# Altium project uz_frontpanel_main.PrjPCB (part 1 of 3)
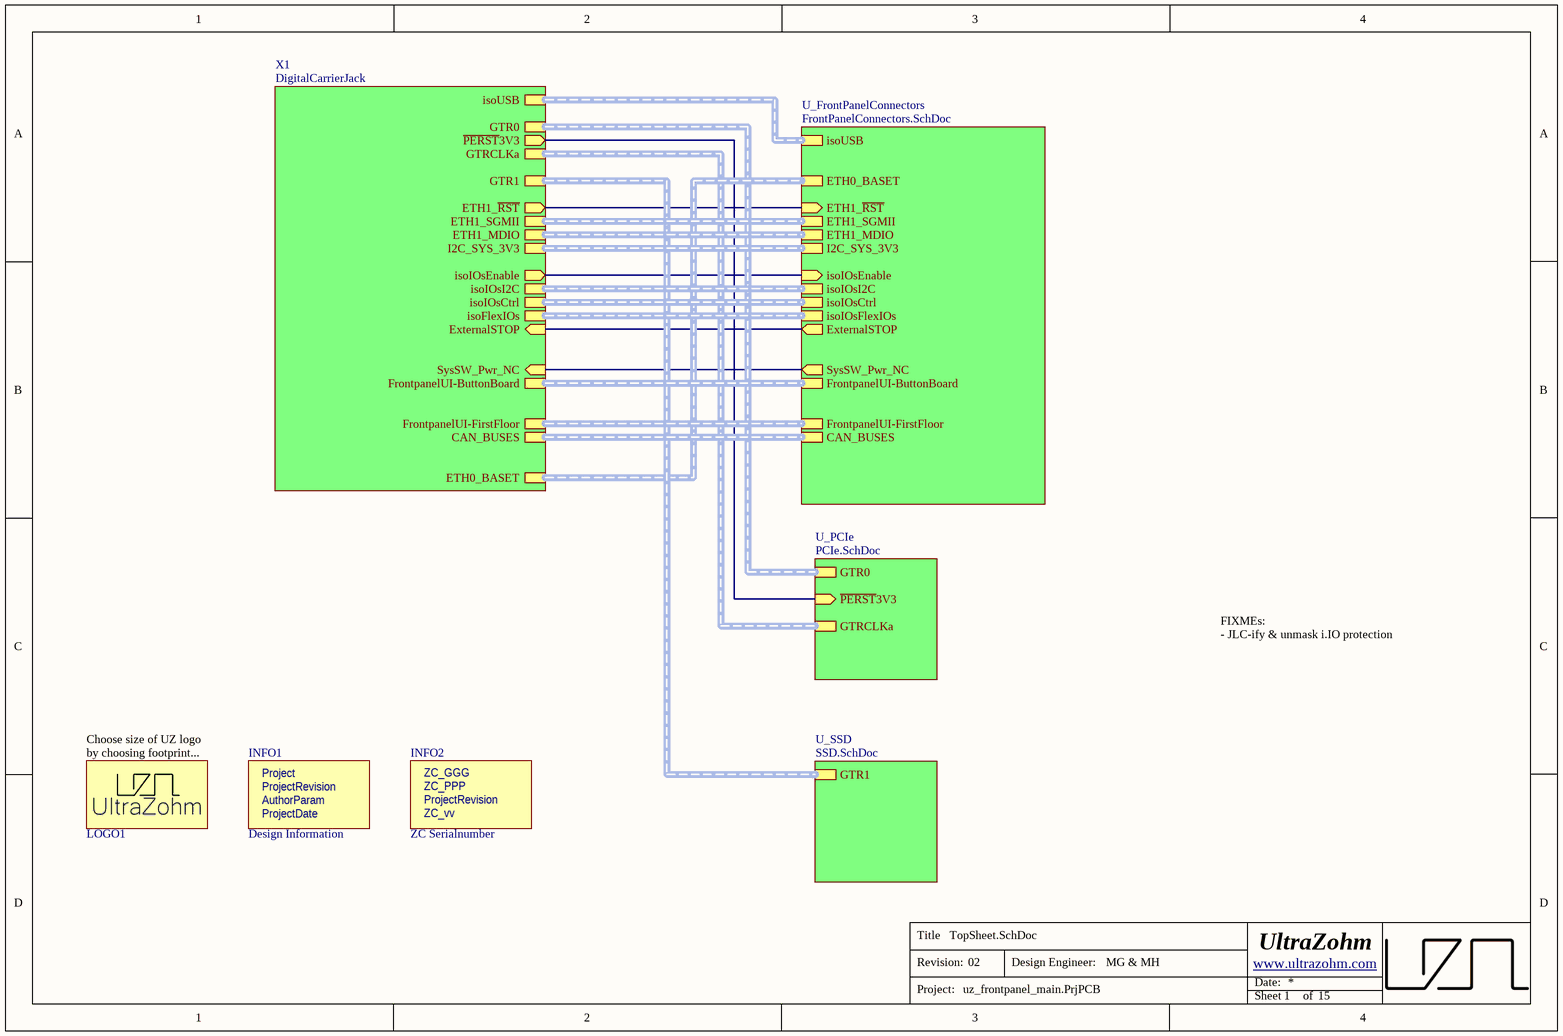
[diagram p0: TopSheet.SchDoc]
AuthorParam: MG & MH; Project: uz_frontpanel_main; ProjectDate: 04/25; ProjectRevision: 02; ZC_GGG: 004; ZC_PPP: 004; Organization: UltraZohm; Website: www.ultrazohm.com
14 sheets, 269 parts. Net scope: hierarchical (ports join the sheet entries above them; power ports are global).
Board file: uz_frontpanel_main.PcbDoc
Sheets:
  TopSheet.SchDoc
    X1 = DigitalCarrierJack.SchDoc
    U_FrontPanelConnectors = FrontPanelConnectors.SchDoc
      U_FPC-isoJTAG = FPC-isoJTAG.SchDoc
      U_FPC-ETH-DualRJ45 = FPC-ETH-DualRJ45.SchDoc
      U_PCB-ButtonBoard = PCB-ButtonBoard.SchDoc
      U_FPC-isoIOs = FPC-isoIOs.SchDoc
        U_FPC-isoIOs-IOpQuad0104 = FPC-isoIOs-IOpQuad.SchDoc
          IOp1 = FPC-isoIOs-IOpSingle.SchDoc
          IOp2 = FPC-isoIOs-IOpSingle.SchDoc
          IOp3 = FPC-isoIOs-IOpSingle.SchDoc
          IOp4 = FPC-isoIOs-IOpSingle.SchDoc
        U_FPC-isoIOs-IOpQuad0508 = FPC-isoIOs-IOpQuad.SchDoc
          IOp1 = FPC-isoIOs-IOpSingle.SchDoc
          IOp2 = FPC-isoIOs-IOpSingle.SchDoc
          IOp3 = FPC-isoIOs-IOpSingle.SchDoc
          IOp4 = FPC-isoIOs-IOpSingle.SchDoc
        U_FPC-isoIOs-IOpQuad0912 = FPC-isoIOs-IOpQuad.SchDoc
          IOp1 = FPC-isoIOs-IOpSingle.SchDoc
          IOp2 = FPC-isoIOs-IOpSingle.SchDoc
          IOp3 = FPC-isoIOs-IOpSingle.SchDoc
          IOp4 = FPC-isoIOs-IOpSingle.SchDoc
        U_FPC-isoIOs-IOpQuad1316 = FPC-isoIOs-IOpQuad.SchDoc
          IOp1 = FPC-isoIOs-IOpSingle.SchDoc
          IOp2 = FPC-isoIOs-IOpSingle.SchDoc
          IOp3 = FPC-isoIOs-IOpSingle.SchDoc
          IOp4 = FPC-isoIOs-IOpSingle.SchDoc
        U_FPC-isoIOs-Power_Protection_AP22653 = FPC-isoIOs-Power_Protection_AP22653.SchDoc
      U_ETH_SGMII-PHY = ETH-PHY_SGMII.SchDoc
      U_PCB-FirstFloor = PCB-FirstFloor.SchDoc
    U_SSD = SSD.SchDoc
    U_PCIe = PCIe.SchDoc

## Sheet TopSheet.SchDoc
size A4; Organization: UltraZohm; SheetNumber: 1; SheetTotal: 15

### Parts
INFO1  Design Information  [Design_info2]  (no BOM)
INFO2  ZC Serialnumber  [ZC-Serial]  (no BOM)
LOGO1  UZ Logo  [UZ_Logo_small]  (value not drawn)  (no BOM)

### Sub-sheets
U_FrontPanelConnectors = FrontPanelConnectors.SchDoc: isoUSB (harness USB), ETH0_BASET (harness ETH_BASET), ETH1_~{RST} (in), ETH1_SGMII (harness ETH_SGMII), ETH1_MDIO (harness ETH_MDIO), isoIOsEnable (in), isoIOsI2C (harness I2C), isoIOsCtrl (harness isoIOsCtrl), isoIOsFlexIOs (harness isoFlexIOs), ExternalSTOP (out), SysSW_Pwr_NC (out), FrontpanelUI-ButtonBoard (harness FrontpanelUI-ButtonBoard), FrontpanelUI-FirstFloor (harness FrontpanelUI-FirstFloor), CAN_BUSES (harness CAN_BUSES), I2C_SYS_3V3 (harness I2C)
U_PCIe = PCIe.SchDoc: GTR0 (harness GTR), ~{PERST}3V3 (in), GTRCLKa (harness MGTCLK)
U_SSD = SSD.SchDoc: GTR1 (harness GTR)
X1 = DigitalCarrierJack: isoUSB (harness USB), ETH0_BASET (harness ETH_BASET), ETH1_~{RST} (out), ETH1_SGMII (harness ETH_SGMII), ETH1_MDIO (harness ETH_MDIO), GTR0 (harness GTR), ~{PERST}3V3 (out), GTRCLKa (harness MGTCLK), GTR1 (harness GTR), isoIOsEnable (out), isoIOsI2C (harness I2C), isoIOsCtrl (harness isoIOsCtrl), isoFlexIOs (harness isoFlexIOs), ExternalSTOP (in), SysSW_Pwr_NC (in), FrontpanelUI-ButtonBoard (harness FrontpanelUI-ButtonBoard), FrontpanelUI-FirstFloor (harness FrontpanelUI-FirstFloor), CAN_BUSES (harness CAN_BUSES), I2C_SYS_3V3 (harness I2C)

### Nets
ETH1_~{RST}: sheet X1/ETH1_~{RST}, sheet U_FrontPanelConnectors/ETH1_~{RST}
ExternalSTOP: sheet X1/ExternalSTOP, sheet U_FrontPanelConnectors/ExternalSTOP
isoIOsEnable: sheet X1/isoIOsEnable, sheet U_FrontPanelConnectors/isoIOsEnable
~{PERST}3V3: sheet X1/~{PERST}3V3, sheet U_PCIe/~{PERST}3V3
SysSW_Pwr_NC: sheet X1/SysSW_Pwr_NC, sheet U_FrontPanelConnectors/SysSW_Pwr_NC

### Buses and harness runs
harness sheet U_FrontPanelConnectors/CAN_BUSES = sheet X1/CAN_BUSES
harness sheet U_FrontPanelConnectors/ETH0_BASET = sheet X1/ETH0_BASET
harness sheet U_FrontPanelConnectors/ETH1_MDIO = sheet X1/ETH1_MDIO
harness sheet U_FrontPanelConnectors/ETH1_SGMII = sheet X1/ETH1_SGMII
harness sheet U_FrontPanelConnectors/FrontpanelUI-ButtonBoard = sheet X1/FrontpanelUI-ButtonBoard
harness sheet U_FrontPanelConnectors/FrontpanelUI-FirstFloor = sheet X1/FrontpanelUI-FirstFloor
harness sheet U_FrontPanelConnectors/I2C_SYS_3V3 = sheet X1/I2C_SYS_3V3
harness sheet U_FrontPanelConnectors/isoIOsCtrl = sheet X1/isoIOsCtrl
harness sheet U_FrontPanelConnectors/isoIOsFlexIOs = sheet X1/isoFlexIOs
harness sheet U_FrontPanelConnectors/isoIOsI2C = sheet X1/isoIOsI2C
harness sheet U_FrontPanelConnectors/isoUSB = sheet X1/isoUSB
harness sheet U_PCIe/GTR0 = sheet X1/GTR0
harness sheet U_PCIe/GTRCLKa = sheet X1/GTRCLKa
harness sheet U_SSD/GTR1 = sheet X1/GTR1

### Notes on the sheet
- (near LOGO1) Choose size of UZ logo by choosing footprint...
- FIXMEs:
  - JLC-ify & unmask i.IO protection
- Title
- Revision:
- Design Engineer:
- Date:
- Project:
- Sheet
- of
- (in symbol Design Information) Project; ProjectRevision; AuthorParam; ProjectDate
- (in symbol ZC-Serial) ZC_GGG; ZC_PPP; ProjectRevision; ZC_vv

### Library data of the parts
INFO1 = Design Information: Manufacturer: UltraZohm; Created from: MGremer; Manufacturer Part Number: Design Information; PartID: 12; Created On: 03/11/2021 09:04:23; ComponentLink1Description: https://docs.ultrazohm.com/; ComponentLink1URL: homepage; Component Type: Design Information; Last Updated: 15/04/2025 09:29:36; Supplier 1: -; Supplier Part Number 1: -; Type: Design Information; Value: Design Information; Live Cycle Status: 1
INFO2 = ZC-Serial: Manufacturer: UltraZohm; Value: GGG-PPP-VVvv; Created from: FRosner; Manufacturer Part Number: ZC-Serial; PartID: 58; Created On: 15/04/2025 09:17:14; ComponentLink1Description: https://docs.ultrazohm.com/; ComponentLink1URL: homepage; Component Type: ZC Serialnumber; Last Updated: 15/04/2025 09:17:14; Supplier 1: -; Supplier Part Number 1: -; Type: Serial Number; Live Cycle Status: 1
LOGO1 = 1: Official Project Logo of the UltraZohm; Manufacturer: PCB Manufacturer; Manufacturer Part Number: UltraZohm Logo; Created from: T. Wendt; PartID: 1; Created On: 19.02.2021 16:55:56; ComponentLink1Description: Homepage; ComponentLink1URL: https://ultrazohm.com; Component Type: Logo; Last Updated: 02.03.2021 14:31:24; Type: Standard (No BOM); Live Cycle Status: 1

## Sheet DigitalCarrierJack.SchDoc
size A4; Organization: UltraZohm; SheetNumber: 2; SheetTotal: 15
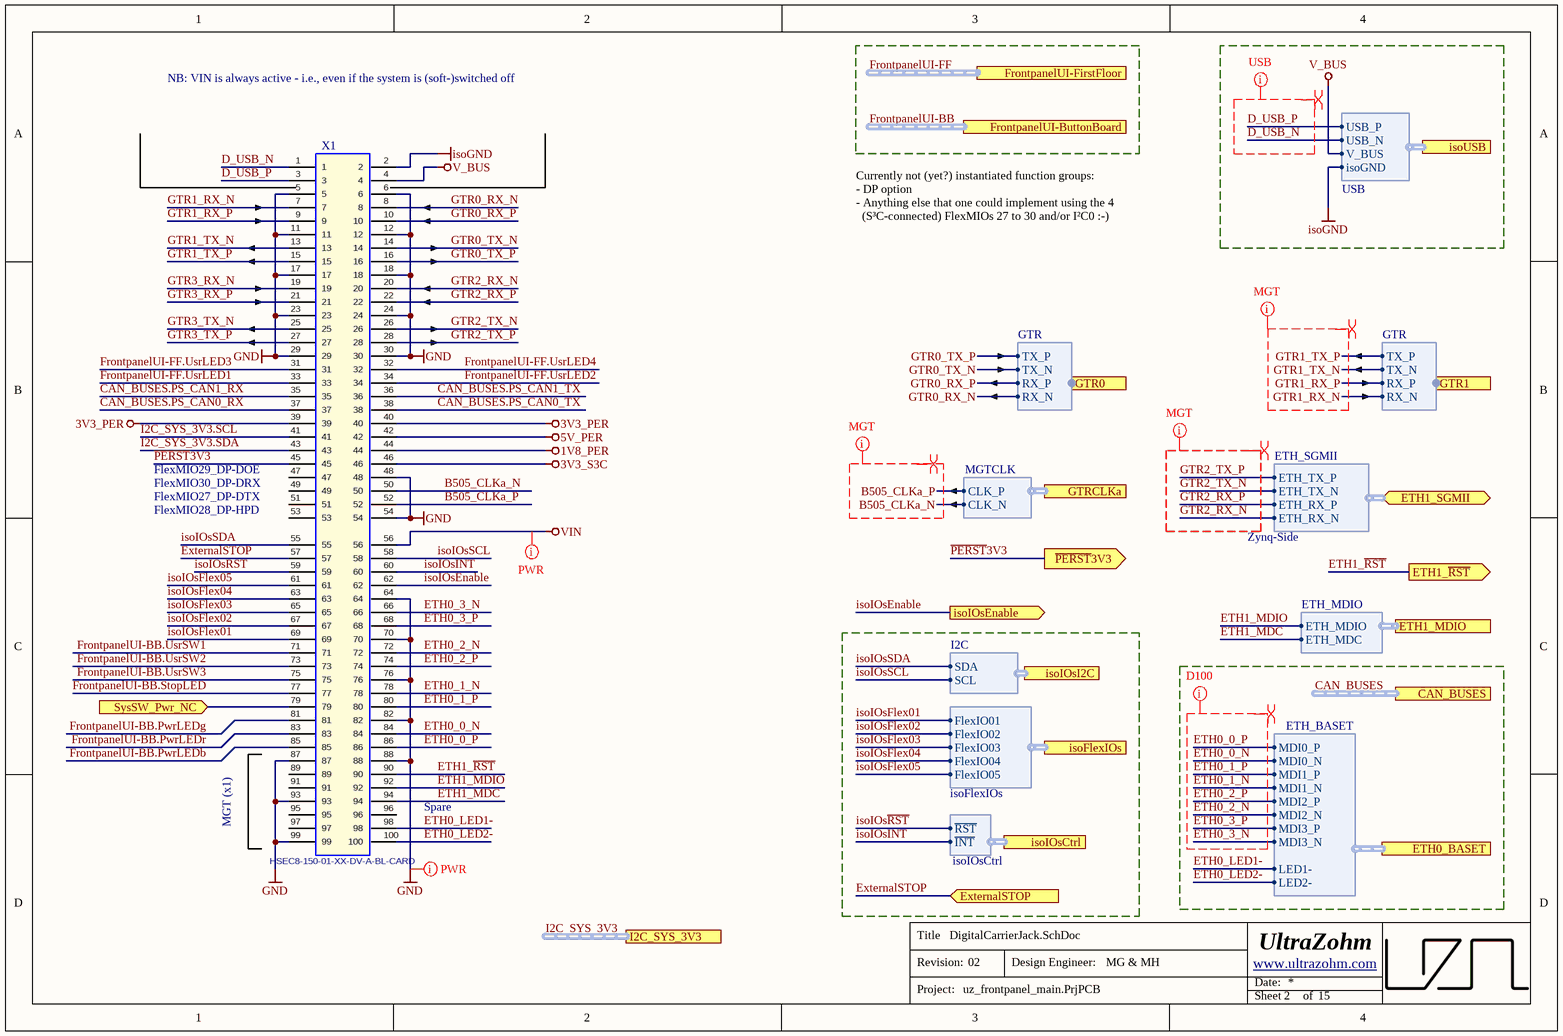
[diagram p1: DigitalCarrierJack.SchDoc]

### Parts
X1  HSEC8-150-01-XX-DV-A-BL-CARD  [HSEC8-150-01-XX-DV-A-BL-CARD]  (no BOM)

### Ports
CAN_BUSES (harness CAN_BUSES), ETH0_BASET (harness ETH_BASET), ETH1_MDIO (harness ETH_MDIO), ETH1_SGMII (bidir, harness ETH_SGMII), ETH1_~{RST} (out), ExternalSTOP (in), FrontpanelUI-ButtonBoard (harness FrontpanelUI-ButtonBoard), FrontpanelUI-FirstFloor (harness FrontpanelUI-FirstFloor), GTR0 (harness GTR), GTR1 (harness GTR), GTRCLKa (harness MGTCLK), I2C_SYS_3V3 (harness I2C), isoFlexIOs (harness isoFlexIOs), isoIOsCtrl (harness isoIOsCtrl), isoIOsEnable (out), isoIOsI2C (harness I2C), isoUSB (harness USB), SysSW_Pwr_NC (in), ~{PERST}3V3 (out)

### Harnesses
USB: USB_P, USB_N, V_BUS, isoGND
ETH_BASET: MDI0_P, MDI0_N, MDI1_P, MDI1_N, MDI2_P, MDI2_N, MDI3_P, MDI3_N, LED1-, LED2-
ETH_SGMII: ETH_RX_N, ETH_RX_P, ETH_TX_N, ETH_TX_P
ETH_MDIO: ETH_MDC, ETH_MDIO
I2C: SCL, SDA
isoFlexIOs: FlexIO01, FlexIO02, FlexIO03, FlexIO04, FlexIO05
isoIOsCtrl: ~{RST}, ~{INT}
GTR: RX_N, RX_P, TX_N, TX_P
MGTCLK: CLK_N, CLK_P

### Nets
1V8_PER: X1.44
3V3_PER: X1.39 X1.40
3V3_S3C: X1.46
5V_PER: X1.42
GND: X1.5 X1.6 X1.11 X1.12 X1.17 X1.18 X1.23 X1.24 X1.29 X1.30 X1.48 X1.54 X1.64 X1.70 X1.76 X1.82 X1.87 X1.88 X1.93 X1.99
isoGND: X1.2 ; port isoUSB.isoGND
V_BUS: X1.4 ; port isoUSB.V_BUS
VIN: X1.56
B505_CLKa_N: X1.50 ; port GTRCLKa.CLK_N
B505_CLKa_P: X1.52 ; port GTRCLKa.CLK_P
CAN_BUSES.PS_CAN0_RX: X1.37
CAN_BUSES.PS_CAN0_TX: X1.38
CAN_BUSES.PS_CAN1_RX: X1.35
CAN_BUSES.PS_CAN1_TX: X1.36
D_USB_N: X1.1 ; port isoUSB.USB_N
D_USB_P: X1.3 ; port isoUSB.USB_P
ETH0_0_N: X1.84 ; port ETH0_BASET.MDI0_N
ETH0_0_P: X1.86 ; port ETH0_BASET.MDI0_P
ETH0_1_N: X1.78 ; port ETH0_BASET.MDI1_N
ETH0_1_P: X1.80 ; port ETH0_BASET.MDI1_P
ETH0_2_N: X1.72 ; port ETH0_BASET.MDI2_N
ETH0_2_P: X1.74 ; port ETH0_BASET.MDI2_P
ETH0_3_N: X1.66 ; port ETH0_BASET.MDI3_N
ETH0_3_P: X1.68 ; port ETH0_BASET.MDI3_P
ETH0_LED1-: X1.98 ; port ETH0_BASET.LED1-  [project net 0L_LED1-]
ETH0_LED2-: X1.100 ; port ETH0_BASET.LED2-  [project net 0L_LED2-]
ETH1_MDC: X1.94 ; port ETH1_MDIO.ETH_MDC
ETH1_MDIO: X1.92 ; port ETH1_MDIO.ETH_MDIO
ETH1_~{RST}: X1.90 ; port ETH1_~{RST}
ExternalSTOP: X1.57 ; port ExternalSTOP
FrontpanelUI-BB.PwrLEDb: X1.85
FrontpanelUI-BB.PwrLEDg: X1.81
FrontpanelUI-BB.PwrLEDr: X1.83
FrontpanelUI-BB.StopLED: X1.77
FrontpanelUI-BB.UsrSW1: X1.71
FrontpanelUI-BB.UsrSW2: X1.73
FrontpanelUI-BB.UsrSW3: X1.75
FrontpanelUI-FF.UsrLED1: X1.33
FrontpanelUI-FF.UsrLED2: X1.34
FrontpanelUI-FF.UsrLED3: X1.31
FrontpanelUI-FF.UsrLED4: X1.32
GTR0_RX_N: X1.8 ; port GTR0.RX_N
GTR0_RX_P: X1.10 ; port GTR0.RX_P
GTR0_TX_N: X1.14 ; port GTR0.TX_N
GTR0_TX_P: X1.16 ; port GTR0.TX_P
GTR1_RX_N: X1.7 ; port GTR1.RX_N
GTR1_RX_P: X1.9 ; port GTR1.RX_P
GTR1_TX_N: X1.13 ; port GTR1.TX_N
GTR1_TX_P: X1.15 ; port GTR1.TX_P
GTR2_RX_N: X1.20 ; port ETH1_SGMII.ETH_RX_N
GTR2_RX_P: X1.22 ; port ETH1_SGMII.ETH_RX_P
GTR2_TX_N: X1.26 ; port ETH1_SGMII.ETH_TX_N
GTR2_TX_P: X1.28 ; port ETH1_SGMII.ETH_TX_P
GTR3_RX_N: X1.19
GTR3_RX_P: X1.21
GTR3_TX_N: X1.25
GTR3_TX_P: X1.27
I2C_SYS_3V3.SCL: X1.41
I2C_SYS_3V3.SDA: X1.43
isoIOsEnable: X1.62 ; port isoIOsEnable
isoIOsFlex01: X1.69 ; port isoFlexIOs.FlexIO01
isoIOsFlex02: X1.67 ; port isoFlexIOs.FlexIO02
isoIOsFlex03: X1.65 ; port isoFlexIOs.FlexIO03
isoIOsFlex04: X1.63 ; port isoFlexIOs.FlexIO04
isoIOsFlex05: X1.61 ; port isoFlexIOs.FlexIO05
isoIOs~{INT}: X1.60 ; port isoIOsCtrl.~{INT}
isoIOs~{RST}: X1.59 ; port isoIOsCtrl.~{RST}
isoIOsSCL: X1.58 ; port isoIOsI2C.SCL
isoIOsSDA: X1.55 ; port isoIOsI2C.SDA
~{PERST}3V3: X1.45 ; port ~{PERST}3V3
SysSW_Pwr_NC: X1.79 ; port SysSW_Pwr_NC

Not connected (* = marked no-connect by the designer): X1 47 49 51 53 89 91 95 96 97

### Buses and harness runs
harness CAN_BUSES = port CAN_BUSES
harness FrontpanelUI-BB = port FrontpanelUI-ButtonBoard
harness FrontpanelUI-FF = port FrontpanelUI-FirstFloor
harness I2C_SYS_3V3 = port I2C_SYS_3V3

### Layout directives
differential pair: B505_CLKa_N, B505_CLKa_P, D_USB_N, D_USB_P, ETH0_0_N, ETH0_0_P, ETH0_1_N, ETH0_1_P, ETH0_2_N, ETH0_2_P, ETH0_3_N, ETH0_3_P, GTR1_RX_N, GTR1_RX_P, GTR1_TX_N, GTR1_TX_P, GTR2_RX_N, GTR2_RX_P, GTR2_TX_N, GTR2_TX_P
net class USB: D_USB_N, D_USB_P
net class D100: ETH0_0_N, ETH0_0_P, ETH0_1_N, ETH0_1_P, ETH0_2_N, ETH0_2_P, ETH0_3_N, ETH0_3_P
net class MGT: B505_CLKa_N, B505_CLKa_P, GTR1_RX_N, GTR1_RX_P, GTR1_TX_N, GTR1_TX_P, GTR2_RX_N, GTR2_RX_P, GTR2_TX_N, GTR2_TX_P
net class PWR: GND, VIN

### Notes on the sheet
- NB: VIN is always active - i.e., even if the system is (soft-)switched off
- Currently not (yet?) instantiated function groups:
  - DP option
  - Anything else that one could implement using the 4
  (S³C-connected) FlexMIOs 27 to 30 and/or I²C0 :-)
- FlexMIO28_DP-HPD
- FlexMIO27_DP-DTX
- FlexMIO30_DP-DRX
- FlexMIO29_DP-DOE
- Zynq-Side
- MGT (x1)
- (near X1) Spare
- Title
- Revision:
- Design Engineer:
- Date:
- Project:
- Sheet
- of

### Library data of the parts
X1 = HSEC8-150-01-XX-DV-A-BL-CARD: Mating Card Layout for HSEC8-150-01-XX-DV-A-BL; Manufacturer: SAMTEC; Created: 2018_04_23_AGeiger; Value: HSEC8-150-01-XX-DV-A-BL-CARD

## Sheet FrontPanelConnectors.SchDoc
size A4; SheetNumber: 5; SheetTotal: 15
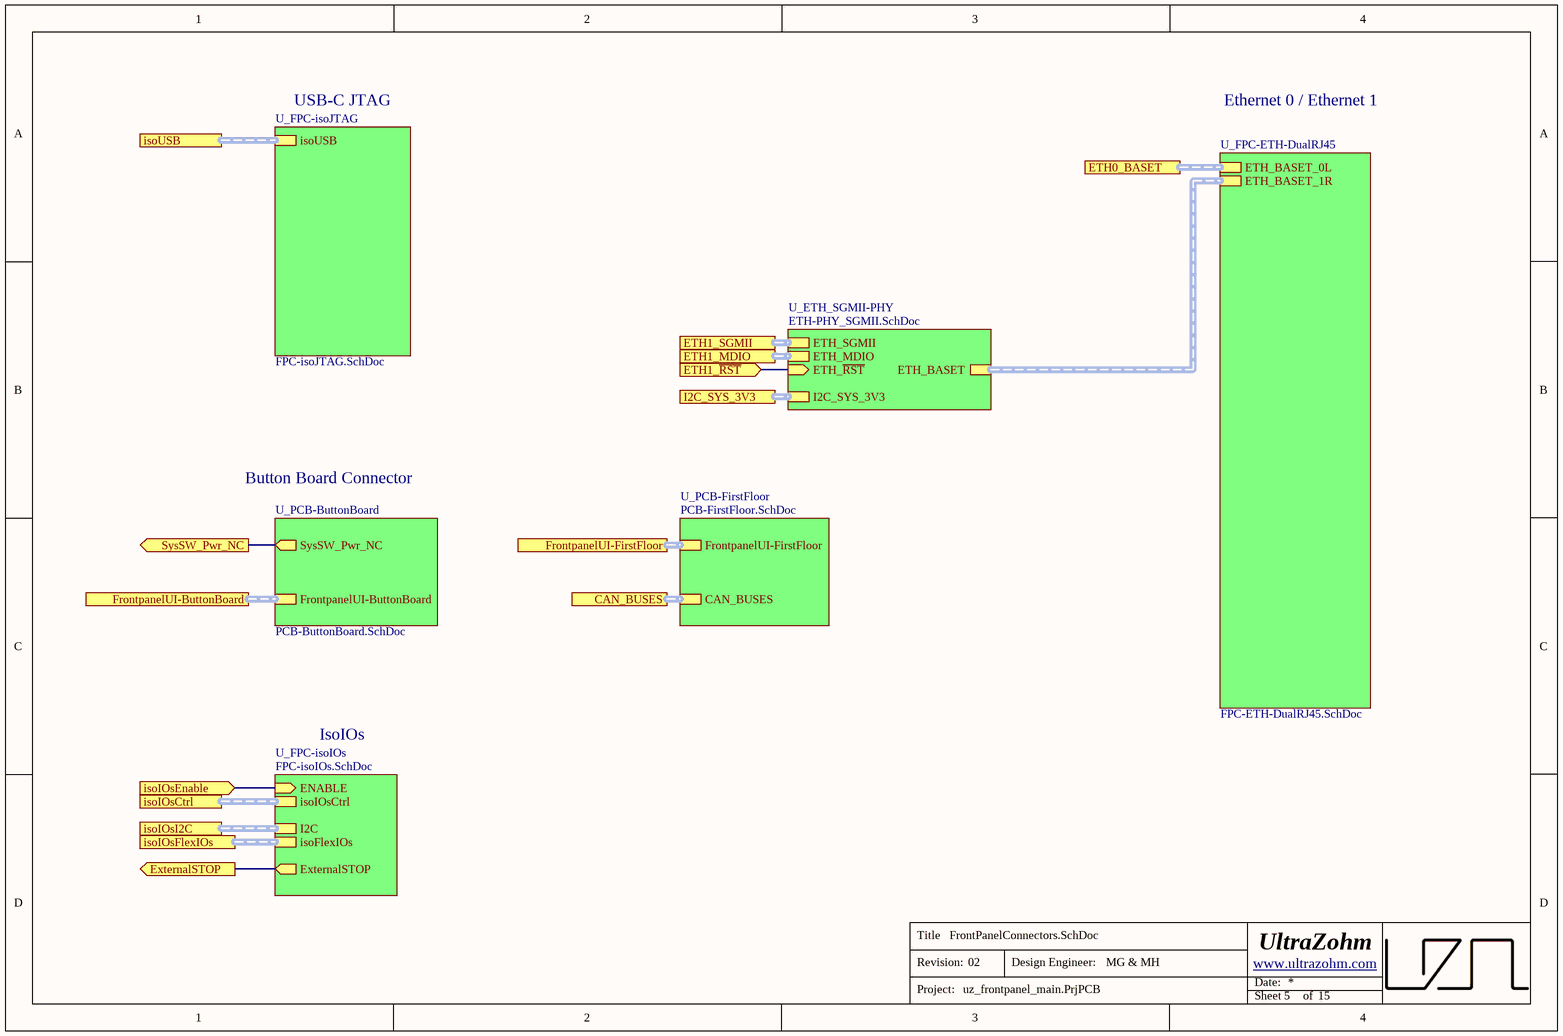
[diagram p2: FrontPanelConnectors.SchDoc]

### Sub-sheets
U_ETH_SGMII-PHY = ETH-PHY_SGMII.SchDoc: ETH_SGMII (harness ETH_SGMII), ETH_MDIO (harness ETH_MDIO), ETH_~{RST} (in), ETH_BASET (harness ETH_BASET), I2C_SYS_3V3 (harness I2C)
U_FPC-ETH-DualRJ45 = FPC-ETH-DualRJ45.SchDoc: ETH_BASET_0L (harness ETH_BASET), ETH_BASET_1R (harness ETH_BASET)
U_FPC-isoIOs = FPC-isoIOs.SchDoc: ENABLE (in), I2C (harness I2C), isoFlexIOs (harness isoFlexIOs), isoIOsCtrl (harness isoIOsCtrl), ExternalSTOP (out)
U_FPC-isoJTAG = FPC-isoJTAG.SchDoc: isoUSB (harness USB)
U_PCB-ButtonBoard = PCB-ButtonBoard.SchDoc: SysSW_Pwr_NC (out), FrontpanelUI-ButtonBoard (harness FrontpanelUI-ButtonBoard)
U_PCB-FirstFloor = PCB-FirstFloor.SchDoc: FrontpanelUI-FirstFloor (harness FrontpanelUI-FirstFloor), CAN_BUSES (harness CAN_BUSES)

### Ports
CAN_BUSES (harness CAN_BUSES), ETH0_BASET (harness ETH_BASET), ETH1_MDIO (harness ETH_MDIO), ETH1_SGMII (harness ETH_SGMII), ETH1_~{RST} (in), ExternalSTOP (out), FrontpanelUI-ButtonBoard (harness FrontpanelUI-ButtonBoard), FrontpanelUI-FirstFloor (harness FrontpanelUI-FirstFloor), I2C_SYS_3V3 (harness I2C), isoIOsCtrl (harness isoIOsCtrl), isoIOsEnable (in), isoIOsFlexIOs (harness isoFlexIOs), isoIOsI2C (harness I2C), isoUSB (harness USB), SysSW_Pwr_NC (out)

### Nets
ETH1_~{RST}: port ETH1_~{RST}, sheet U_ETH_SGMII-PHY/ETH_~{RST}
ExternalSTOP: port ExternalSTOP, sheet U_FPC-isoIOs/ExternalSTOP
isoIOsEnable: port isoIOsEnable, sheet U_FPC-isoIOs/ENABLE
SysSW_Pwr_NC: port SysSW_Pwr_NC, sheet U_PCB-ButtonBoard/SysSW_Pwr_NC

### Buses and harness runs
harness port CAN_BUSES = sheet U_PCB-FirstFloor/CAN_BUSES
harness port ETH0_BASET = sheet U_FPC-ETH-DualRJ45/ETH_BASET_0L
harness port ETH1_MDIO = sheet U_ETH_SGMII-PHY/ETH_MDIO
harness port ETH1_SGMII = sheet U_ETH_SGMII-PHY/ETH_SGMII
harness port FrontpanelUI-ButtonBoard = sheet U_PCB-ButtonBoard/FrontpanelUI-ButtonBoard
harness port FrontpanelUI-FirstFloor = sheet U_PCB-FirstFloor/FrontpanelUI-FirstFloor
harness port I2C_SYS_3V3 = sheet U_ETH_SGMII-PHY/I2C_SYS_3V3
harness port isoIOsCtrl = sheet U_FPC-isoIOs/isoIOsCtrl
harness port isoIOsFlexIOs = sheet U_FPC-isoIOs/isoFlexIOs
harness port isoIOsI2C = sheet U_FPC-isoIOs/I2C
harness port isoUSB = sheet U_FPC-isoJTAG/isoUSB
harness sheet U_ETH_SGMII-PHY/ETH_BASET = sheet U_FPC-ETH-DualRJ45/ETH_BASET_1R

### Notes on the sheet
- USB-C JTAG
- Ethernet 0 / Ethernet 1
- Button Board Connector
- IsoIOs
- Title
- Revision:
- Design Engineer:
- Date:
- Project:
- Sheet
- of

## Sheet FPC-isoJTAG.SchDoc
size A4; SheetNumber: 10; SheetTotal: 15
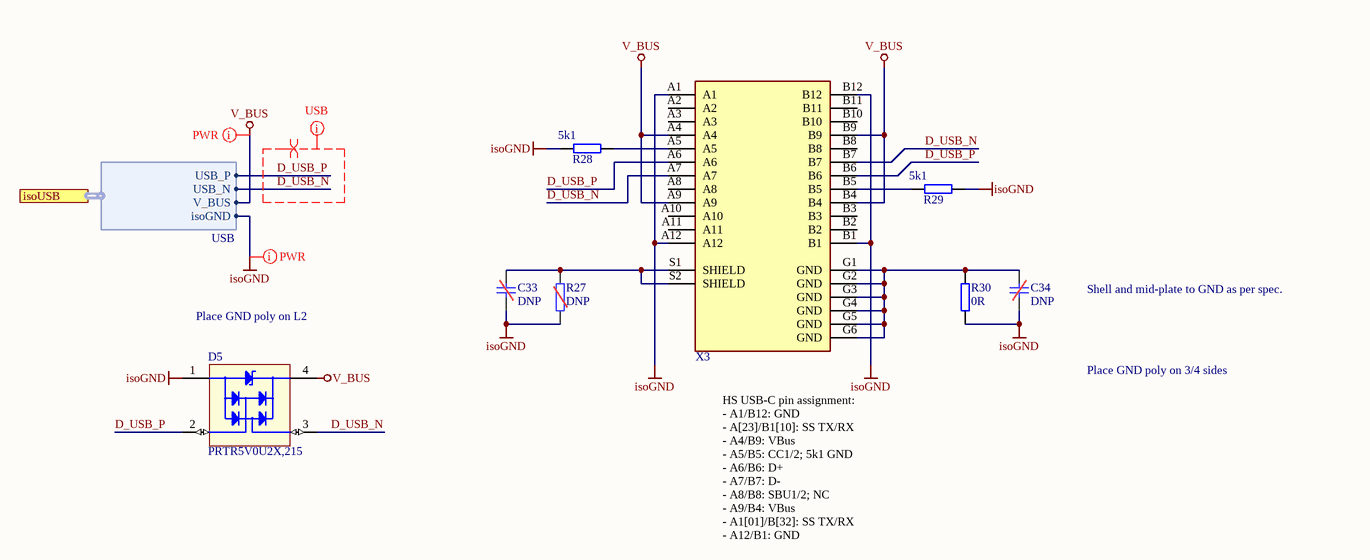
[diagram p3: FPC-isoJTAG.SchDoc]

### Parts
C33  DNP  [C_1206_TE-DNP]  (no BOM)
C34  DNP  [C_1206_TE-DNP]  (no BOM)
D5  PRTR5V0U2X,215  [SOT-143B-4]
R27  DNP  [R_1206_TE-DNP]  (no BOM)
R28  5k1  [R_0603_TE]
R29  5k1  [R_0603_TE]
R30  0R  [R_1206_TE]
X3  (no value)  [AMPHENOL_MUSBRM1C130_CUSTOMPADLEN3.05mm]

### Ports
isoUSB (harness USB)

### Harnesses
USB: USB_P, USB_N, V_BUS, isoGND

### Nets
isoGND: C33.1 C34.1 D5.1(GND) R27.1 R28.1 R29.2 R30.1 X3.A1 X3.A12 X3.B1 X3.B12 ; port isoUSB.isoGND
V_BUS: D5.4(REF) X3.A4 X3.A9 X3.B4 X3.B9 ; port isoUSB.V_BUS
D_USB_N: D5.3(I/O) X3.A7 X3.B7 ; port isoUSB.USB_N
D_USB_P: D5.2(I/O) X3.A6 X3.B6 ; port isoUSB.USB_P
NetC33_2: C33.2 R27.2 X3.S1(SHIELD) X3.S2(SHIELD)
NetC34_2: C34.2 R30.2 X3.G1(GND) X3.G2(GND) X3.G3(GND) X3.G4(GND) X3.G5(GND) X3.G6(GND)
NetR28_2: R28.2 X3.A5
NetR29_1: R29.1 X3.B5

Not connected (* = marked no-connect by the designer): X3 A2 A3 A8 A10 A11 B2 B3 B8 B10 B11

### Layout directives
differential pair: D_USB_N, D_USB_P
net class USB: D_USB_N, D_USB_P
net class PWR: isoGND, V_BUS

### Notes on the sheet
- Shell and mid-plate to GND as per spec.
- Place GND poly on L2
- Place GND poly on 3/4 sides
- HS USB-C pin assignment:
  - A1/B12: GND
  - A[23]/B1[10]: SS TX/RX
  - A4/B9: VBus
  - A5/B5: CC1/2; 5k1 GND
  - A6/B6: D+
  - A7/B7: D-
  - A8/B8: SBU1/2; NC
  - A9/B4: VBus
  - A1[01]/B[32]: SS TX/RX
  - A12/B1: GND
- Title
- Revision:
- Design Engineer:
- Date:
- Project:
- Sheet
- of

### Library data of the parts
C33 C34 = UZgen_C_1206_DNP: Generic capacitor (DNP); Manufacturer: UZgen; Created from: UZgenTool; Manufacturer Part Number: UZgen_C_1206_DNP; PartID: 5814; Created On: 29/03/2025 17:15:00; Value: DNP; Device Package: 1206; Voltage: -; Technology: -; Tolerance: -; Mounting Type: SMD; Last Updated: 02/04/2025 19:05:00
D5 = PRTR5V0U2X,215: ESD Suppressors / TVS Diodes PRTR5V0U2X/SOT143/SOT4; Manufacturer: Nexperia; Type: TVS-Diode; Created from: AGeiger; Manufacturer Part Number: PRTR5V0U2X,215; PartID: 10; Created On: 26.11.2023 17:14:11; ComponentLink1Description: Datasheet; ComponentLink1URL: https://www.mouser.de/datasheet/2/916/PRTR5V0U2X-2938759.pdf; Component Type: TVS Diode, ESD; Device Package: SOT-143B-4; Last Updated: 26.11.2023 17:16:37; Mounting Type: SMD; Operating Temperature: -40 to 85 °C; Supplier 1: Mouser; Supplier Part Number 1: 771-PRTR5V0U2X-T/R; Supplier 2: LCSC; Supplier Part Number 2: C12333; Value: PRTR5V0U2X,215; Live Cycle Status: 1; LCSC Part Number: C12333
R27 = UZgen_R_1206_DNP: Generic resistor (DNP); Manufacturer: UZgen; Created from: UZgenTool; Manufacturer Part Number: UZgen_R_1206_DNP; PartID: 595; Created On: 25/03/2025 14:26:15; Value: DNP; Device Package: 1206; Tolerance: -; Mounting Type: SMD; Last Updated: 02/04/2025 19:05:00
R28 R29 = UZgen_R_0603_5k1: Generic resistor; Manufacturer: UZgen; Tolerance: 1 %; Created from: UZgenTool; Manufacturer Part Number: UZgen_R_0603_5k1; PartID: 238; Created On: 02/07/2024 17:29:50; Value: 5k1; Device Package: 0603; Mounting Type: SMD; Last Updated: 02/07/2024 17:29:50
R30 = UZgen_R_1206_0R: Generic resistor; Manufacturer: UZgen; Tolerance: 1 %; Created from: UZgenTool; Manufacturer Part Number: UZgen_R_1206_0R; PartID: 583; Created On: 08/07/2024 14:34:30; Value: 0R; Device Package: 1206; Mounting Type: SMD; Last Updated: 08/07/2024 14:34:30
X3 = MUSBRM1C1M0: USB Connectors RUGGED TYPE C RIGHT ANGLE; Manufacturer: Amphenol; Created from: FRosner; MF: Amphenol ICC (Commercial Products); Manufacturer Part Number: MUSBRM1C1M0; PartID: 34; Created On: 04/07/2024 09:07:50; ComponentLink1Description: Datasheet; ComponentLink1URL: https://www.mouser.de/datasheet/2/18/2/io_harsh_musb_type_c-3369676.pdf; Last Updated: 02/04/2025 16:50:00; Mounting Type: THT; Operating Temperature: -40 °C to +105 °C; Series: MUSBR; Supplier 1: Mouser; Supplier Part Number 1: 523-MUSBRM1C1M0; Supplier 2: LCSC; Supplier Part Number 2: C3197960; Value: MUSBRM1C1M0; LCSC Part Number: C3197960; MP: MUSBRM1C130; Package: None; Price: None; Availability: Unavailable

## Sheet FPC-ETH-DualRJ45.SchDoc
size A4; SheetNumber: 13; SheetTotal: 15
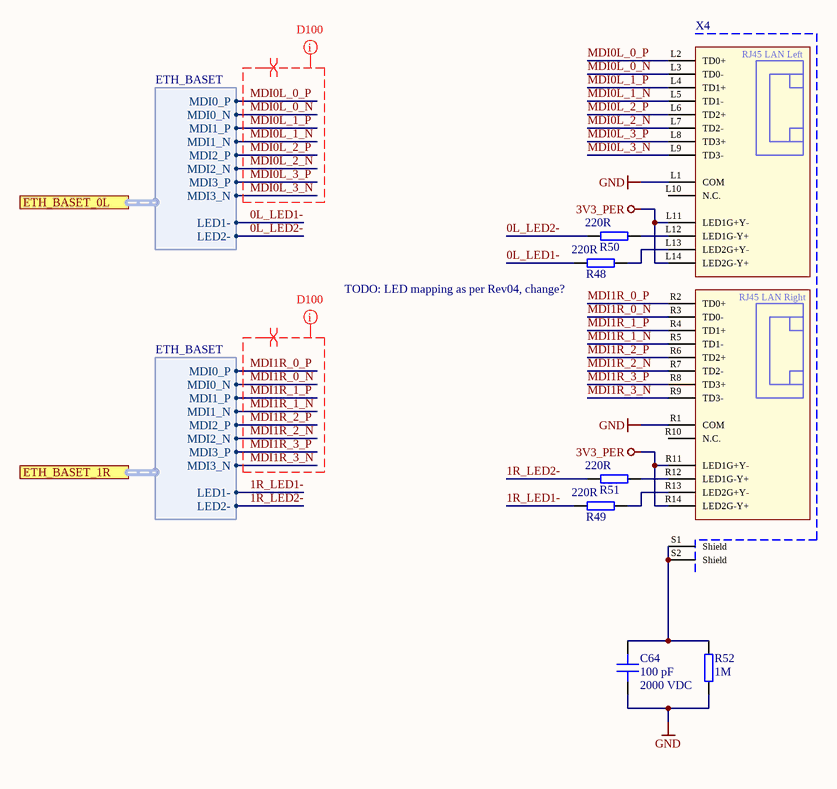
[diagram p4: FPC-ETH-DualRJ45.SchDoc]

### Parts
C64  100 pF  Voltage Rating: 2000 VDC  [C_1206_TE]
R48  220R  [R_0603_TE]
R49  220R  [R_0603_TE]
R50  220R  [R_0603_TE]
R51  220R  [R_0603_TE]
R52  1M  [RES 1206_3216]
X4  (no value)  [74991214400]

### Ports
ETH_BASET_0L (harness ETH_BASET), ETH_BASET_1R (harness ETH_BASET)

### Harnesses
ETH_BASET: MDI0_P, MDI0_N, MDI1_P, MDI1_N, MDI2_P, MDI2_N, MDI3_P, MDI3_N, LED1-, LED2-

### Nets
3V3_PER: X4.L11(LED1G+Y-) X4.L14(LED2G-Y+) X4.R11(LED1G+Y-) X4.R14(LED2G-Y+)
GND: C64.1 R52.1 X4.L1(COM) X4.R1(COM)
0L_LED1-: R48.1 ; port ETH_BASET_0L.LED1-
0L_LED2-: R50.1 ; port ETH_BASET_0L.LED2-
1R_LED1-: R49.1 ; port ETH_BASET_1R.LED1-
1R_LED2-: R51.1 ; port ETH_BASET_1R.LED2-
MDI0L_0_N: X4.L3(TD0-) ; port ETH_BASET_0L.MDI0_N  [project net ETH0_0_N]
MDI0L_0_P: X4.L2(TD0+) ; port ETH_BASET_0L.MDI0_P  [project net ETH0_0_P]
MDI0L_1_N: X4.L5(TD1-) ; port ETH_BASET_0L.MDI1_N  [project net ETH0_1_N]
MDI0L_1_P: X4.L4(TD1+) ; port ETH_BASET_0L.MDI1_P  [project net ETH0_1_P]
MDI0L_2_N: X4.L7(TD2-) ; port ETH_BASET_0L.MDI2_N  [project net ETH0_2_N]
MDI0L_2_P: X4.L6(TD2+) ; port ETH_BASET_0L.MDI2_P  [project net ETH0_2_P]
MDI0L_3_N: X4.L9(TD3-) ; port ETH_BASET_0L.MDI3_N  [project net ETH0_3_N]
MDI0L_3_P: X4.L8(TD3+) ; port ETH_BASET_0L.MDI3_P  [project net ETH0_3_P]
MDI1R_0_N: X4.R3(TD0-) ; port ETH_BASET_1R.MDI0_N
MDI1R_0_P: X4.R2(TD0+) ; port ETH_BASET_1R.MDI0_P
MDI1R_1_N: X4.R5(TD1-) ; port ETH_BASET_1R.MDI1_N
MDI1R_1_P: X4.R4(TD1+) ; port ETH_BASET_1R.MDI1_P
MDI1R_2_N: X4.R7(TD2-) ; port ETH_BASET_1R.MDI2_N
MDI1R_2_P: X4.R6(TD2+) ; port ETH_BASET_1R.MDI2_P
MDI1R_3_N: X4.R9(TD3-) ; port ETH_BASET_1R.MDI3_N
MDI1R_3_P: X4.R8(TD3+) ; port ETH_BASET_1R.MDI3_P
NetC64_2: C64.2 R52.2 X4.S1(Shield) X4.S2(Shield)
NetR48_2: R48.2 X4.L13(LED2G+Y-)
NetR49_2: R49.2 X4.R13(LED2G+Y-)
NetR50_2: R50.2 X4.L12(LED1G-Y+)
NetR51_2: R51.2 X4.R12(LED1G-Y+)

Not connected (* = marked no-connect by the designer): X4 L10(N.C.) R10(N.C.)

### Layout directives
differential pair: MDI0L_0_N, MDI0L_0_P, MDI0L_1_N, MDI0L_1_P, MDI0L_2_N, MDI0L_2_P, MDI0L_3_N, MDI0L_3_P, MDI1R_0_N, MDI1R_0_P, MDI1R_1_N, MDI1R_1_P, MDI1R_2_N, MDI1R_2_P, MDI1R_3_N, MDI1R_3_P
net class D100: MDI0L_0_N, MDI0L_0_P, MDI0L_1_N, MDI0L_1_P, MDI0L_2_N, MDI0L_2_P, MDI0L_3_N, MDI0L_3_P, MDI1R_0_N, MDI1R_0_P, MDI1R_1_N, MDI1R_1_P, MDI1R_2_N, MDI1R_2_P, MDI1R_3_N, MDI1R_3_P

### Notes on the sheet
- (near R48) TODO: LED mapping as per Rev04, change?
- Title
- Revision:
- Design Engineer:
- Date:
- Project:
- Sheet
- of
- (in symbol 74991214400) RJ45 LAN Left; RJ45 LAN Right

### Library data of the parts
C64 = CC1206JKNPODBN101: 2kV 100pF NP0 ±5% 1206 Multilayer Ceramic Capacitors MLCC - SMD/SMT ROHS; Manufacturer: YAGEO; Created from: AGeiger; Manufacturer Part Number: CC1206JKNPODBN101; PartID: 115; Created On: 02/12/2022 11:59:53; ComponentLink1Description: Datasheet; ComponentLink1URL: https://datasheet.lcsc.com/lcsc/2108131530_YAGEO-CC1206JKNPODBN101_C113876.pdf; Component Type: Capacitor 1206; Device Package: 1206; Last Updated: 22/04/2025 15:53:45; Mounting Type: SMD; Operating Temperature: -55 to +125°C; Series: NP0; Supplier 1: LCSC; Supplier Part Number 1: C113876; Type: Capacitor; Tolerance: 5 %; Value: 100 pF; Live Cycle Status: 1; LCSC Part Number: C113876
R48-R51 = UZgen_R_0603_220R: Generic resistor; Manufacturer: UZgen; Tolerance: 1 %; Created from: UZgenTool; Manufacturer Part Number: UZgen_R_0603_220R; PartID: 205; Created On: 02/07/2024 17:29:49; Value: 220R; Device Package: 0603; Mounting Type: SMD; Last Updated: 02/07/2024 17:29:49
R52 = 1206W4F1004T5E: 250mW Thick Film Resistors 200V ±100ppm/℃ ±1% -55℃~+155℃ 1MΩ 1206 Chip Resistor - Surface Mount ROHS; Manufacturer: UNI-ROYAL; Created from: AGeiger; Manufacturer Part Number: 1206W4F1004T5E; PartID: 248; Created On: 02.12.2022 11:50:50; ComponentLink1Description: Datasheet; ComponentLink1URL: https://datasheet.lcsc.com/lcsc/2206010145_UNI-ROYAL-Uniroyal-Elec-1206W4F1004T5E_C17927.pdf; Component Type: SMD resistor; Device Package: 1206; Last Updated: 02.12.2022 11:50:50; Mounting Type: SMD; Supplier 1: LCSC; Supplier Part Number 1: C17927; Type: Resistor; Tolerance: 1%; Value: 1M; Live Cycle Status: 1; LCSC Part Number: C17927
X4 = 74991214400: Dual (1x2) 1000BASE-T Ethernet (1-GigE) Connector with downward tabs, ground fingers and dual-green/yellow LEDs per port; Manufacturer: Würth Elektronik; Created from: MGeier; Manufacturer Part Number: 74991214400; PartID: 39; Created On: 31/07/2024 14:15:42; ComponentLink1Description: Datasheet; ComponentLink1URL: https://www.we-online.com/components/products/datasheet/74991214400.pdf; Last Updated: 08/10/2024 12:21:15; Mounting Type: THT; Operating Temperature: -40 up to +85 °C; Series: WE-RJ45 LAN; Supplier 1: DigiKey; Supplier Part Number 1: 732-74991214400-ND; Value: 74991214400; LCSC Part Number: C29641821; ComponentLink2Description: Homepage; ComponentLink2URL: https://www.we-online.com/en/components/products/WE-LAN-RJ45; Supplier 2: Mouser; Supplier Part Number 2: 710-74991214400; Supplier 3: LCSC; Supplier Part Number 3: C29641821

## Sheet PCB-ButtonBoard.SchDoc
size A4; SheetNumber: 14; SheetTotal: 15
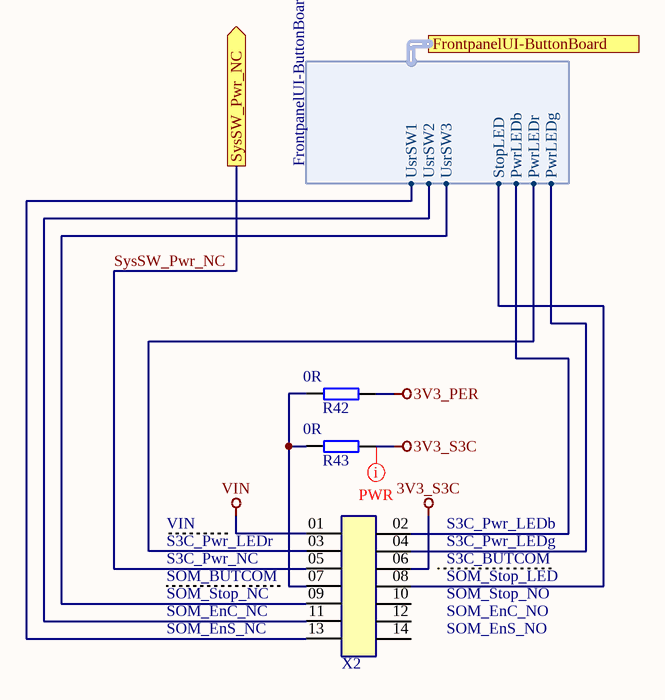
[diagram p5: PCB-ButtonBoard.SchDoc]

### Parts
(Parts that share a designator on the sheet are numbered #1, #2 ... from top to bottom, then left to right.)
R42#1  0R  [R_0603_TE]
R43#1  0R  [R_0603_TE]
X2  (no value)  [RHDRRA14W79P254_2X7_1829X851X495P]

### Ports
FrontpanelUI-ButtonBoard (harness FrontpanelUI-ButtonBoard), SysSW_Pwr_NC (out)

### Harnesses
FrontpanelUI-ButtonBoard: UsrSW1, UsrSW2, UsrSW3, StopLED, PwrLEDb, PwrLEDr, PwrLEDg

### Nets
3V3_PER: R42#1.2
3V3_S3C: R43#1.2 X2.06
VIN: X2.01
FrontpanelUI-BB.PwrLEDb: X2.02 ; port FrontpanelUI-ButtonBoard.PwrLEDb
FrontpanelUI-BB.PwrLEDg: X2.04 ; port FrontpanelUI-ButtonBoard.PwrLEDg
FrontpanelUI-BB.PwrLEDr: X2.03 ; port FrontpanelUI-ButtonBoard.PwrLEDr
FrontpanelUI-BB.StopLED: X2.08 ; port FrontpanelUI-ButtonBoard.StopLED
FrontpanelUI-BB.UsrSW1: X2.13 ; port FrontpanelUI-ButtonBoard.UsrSW1
FrontpanelUI-BB.UsrSW2: X2.11 ; port FrontpanelUI-ButtonBoard.UsrSW2
FrontpanelUI-BB.UsrSW3: X2.09 ; port FrontpanelUI-ButtonBoard.UsrSW3
SysSW_Pwr_NC: X2.05 ; port SysSW_Pwr_NC
NetR42#1_1: R42#1.1 R43#1.1 X2.07

Not connected (* = marked no-connect by the designer): X2 10 12 14

### Layout directives
net class PWR: 3V3_S3C

### Notes on the sheet
- S3C_Pwr_LEDr
- S3C_Pwr_NC
- SOM_BUTCOM
- VIN
- S3C_Pwr_LEDb
- S3C_Pwr_LEDg
- S3C_BUTCOM
- SOM_Stop_LED
- SOM_Stop_NC
- SOM_EnC_NC
- SOM_EnS_NC
- SOM_Stop_NO
- SOM_EnC_NO
- SOM_EnS_NO
- Title
- Revision:
- Design Engineer:
- Date:
- Project:
- Sheet
- of

### Library data of the parts
R42#1 R43#1 = UZgen_R_0603_0R: Generic resistor; Manufacturer: UZgen; Tolerance: 1 %; Created from: UZgenTool; Manufacturer Part Number: UZgen_R_0603_0R; PartID: 581; Created On: 08/07/2024 14:34:30; Value: 0R; Device Package: 0603; Mounting Type: SMD; Last Updated: 08/07/2024 14:34:30
X2 = PM254-2-07-W-8.5: [low-cost SSW-107-22-F-D-RA] Headers & Wire Housings Tiger Buy Socket Strip with PCB Tails, .100" Pitch; Manufacturer: HCTL; Created from: FRosner/MGeier; Manufacturer Part Number: PM254-2-07-W-8.5; PartID: 43; Created On: 03.07.2024 09:52:49; ComponentLink1Description: Datasheet; ComponentLink1URL: https://wmsc.lcsc.com/wmsc/upload/file/pdf/v2/lcsc/2306091006_HCTL-PM254-2-07-W-8-5_C2897427.pdf; Last Updated: 17.08.2024 14:55:01; Mounting Type: THT; Operating Temperature: -40℃~+105℃; Supplier 1: LCSC; Supplier Part Number 1: C2897427; Value: PM254-2-07-W-8.5; LCSC Part Number: C2897427

## Sheet FPC-isoIOs.SchDoc
size A4; SheetNumber: 6; SheetTotal: 15
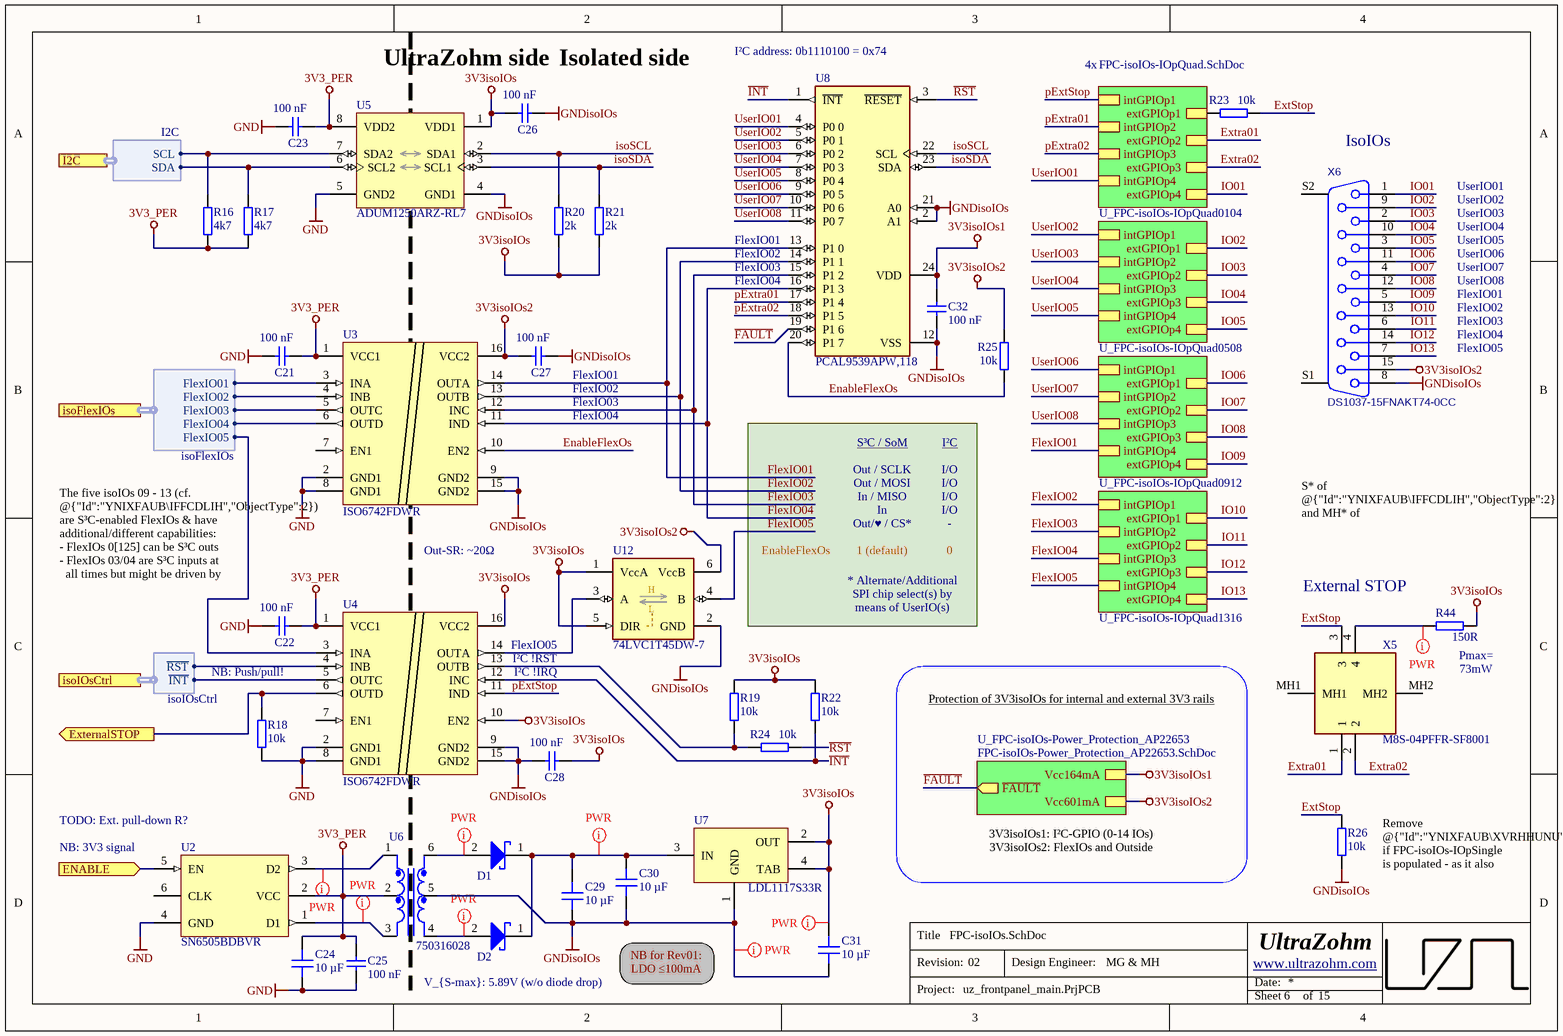
[diagram p6: FPC-isoIOs.SchDoc]

### Parts
C21  100 nF  [C_0603_TE]
C22  100 nF  [C_0603_TE]
C23  100 nF  [C_0603_TE]
C24  10 µF  [C_0603_TE]
C25  100 nF  [C_0603_TE]
C26  100 nF  [C_0603_TE]
C27  100 nF  [C_0603_TE]
C28  100 nF  [C_0603_TE]
C29  10 µF  [C_0603_TE]
C30  10 µF  [C_0603_TE]
C31  10 µF  [C_0603_TE]
C32  100 nF  [C_0603_TE]
D1  PMEG3010ER,115  [FP-SOD123W-MFG-DotOn1]  (value not drawn)
D2  PMEG3010ER,115  [FP-SOD123W-MFG-DotOn1]  (value not drawn)
R16  4k7  [R_0603_TE]
R17  4k7  [R_0603_TE]
R18  10k  [R_0603_TE]
R19  10k  [R_0603_TE]
R20  2k  [R_0603_TE]
R21  2k  [R_0603_TE]
R22  10k  [R_0603_TE]
R23  10k  [R_0603_TE]
R24  10k  [R_0603_TE]
R25  10k  [R_0603_TE]
R26  10k  [R_0603_TE]
R44  150R  [R_0603_TE]
U2  SN6505BDBVR  [TI_SOT23_6-Leads]
U3  ISO6742FDWR  [SOIC127P1030X265-16N]
U4  ISO6742FDWR  [SOIC127P1030X265-16N]
U5  ADUM1250ARZ-RL7  [ADI-R-8_N]
U6  750316028  [750316028]
U7  LDL1117S33R  [SOT230P700X170-4N]
U8  PCAL9539APW,118  [FP-SOT355-1-IPC_B]
U12  74LVC1T45DW-7  [SOT-363]
X5  M8S-04PFFR-SF8001  [M8S04PFFRSF8001]
X6  DS1037-15FNAKT74-0CC  [PCB - MISC - DSUB15]

### Sub-sheets
U_FPC-isoIOs-IOpQuad0104 = FPC-isoIOs-IOpQuad.SchDoc: intGPIOp1, intGPIOp2, intGPIOp3, intGPIOp4, extGPIOp1, extGPIOp2, extGPIOp3, extGPIOp4
U_FPC-isoIOs-IOpQuad0508 = FPC-isoIOs-IOpQuad.SchDoc: intGPIOp1, intGPIOp2, intGPIOp3, intGPIOp4, extGPIOp1, extGPIOp2, extGPIOp3, extGPIOp4
U_FPC-isoIOs-IOpQuad0912 = FPC-isoIOs-IOpQuad.SchDoc: intGPIOp1, intGPIOp2, intGPIOp3, intGPIOp4, extGPIOp1, extGPIOp2, extGPIOp3, extGPIOp4
U_FPC-isoIOs-IOpQuad1316 = FPC-isoIOs-IOpQuad.SchDoc: intGPIOp1, intGPIOp2, intGPIOp3, intGPIOp4, extGPIOp1, extGPIOp2, extGPIOp3, extGPIOp4
U_FPC-isoIOs-Power_Protection_AP22653 = FPC-isoIOs-Power_Protection_AP22653.SchDoc: ~{FAULT} (out), Vcc164mA, Vcc601mA

### Ports
ENABLE (in), ExternalSTOP (out), I2C (harness I2C), isoFlexIOs (harness isoFlexIOs), isoIOsCtrl (harness isoIOsCtrl)

### Harnesses
I2C: SCL, SDA
isoFlexIOs: FlexIO01, FlexIO02, FlexIO03, FlexIO04, FlexIO05
isoIOsCtrl: ~{RST}, ~{INT}

### Nets
3V3_PER: C21.2 C22.2 C23.2 C24.1 C25.2 R16.1 R17.1 U2.2(VCC) U3.1(VCC1) U4.1(VCC1) U5.8(VDD2) U6.2
3V3isoIOs: C26.1 C28.2 C31.2 R19.2 R20.1 R21.1 R22.2 R44.2 U4.10(EN2) U4.16(VCC2) U5.1(VDD1) U7.2(OUT) U7.4(TAB) U12.1(VccA) U12.5(DIR)
3V3isoIOs1: C32.1 U8.24(VDD) ; sheet U_FPC-isoIOs-Power_Protection_AP22653/Vcc164mA
3V3isoIOs2: C27.1 R25.2 U3.16(VCC2) U12.6(VccB) X6.15 ; sheet U_FPC-isoIOs-Power_Protection_AP22653/Vcc601mA
GND: C21.1 C22.1 C23.1 C24.2 C25.1 R18.1 U2.4(GND) U3.2(GND1) U3.8(GND1) U4.2(GND1) U4.8(GND1) U5.5(GND2)
GNDisoIOs: C26.2 C27.2 C28.1 C29.1 C30.1 C31.1 C32.2 R26.1 U3.9(GND2) U3.15(GND2) U4.9(GND2) U4.15(GND2) U5.4(GND1) U6.5 U7.1(GND) U8.2(A1) U8.12(VSS) U8.21(A0) U12.2(GND) X6.8
EnableFlexOs: R25.1 U3.10(EN2) U8.20(P1_7)
ExternalSTOP: R18.2 U4.6(OUTD) ; port ExternalSTOP
Extra01: U8.17(P1_4) X5.1 ; sheet U_FPC-isoIOs-IOpQuad0104/intGPIOp2, sheet U_FPC-isoIOs-IOpQuad0104/extGPIOp2  [also labelled pExtra01]
Extra02: U8.18(P1_5) X5.2 ; sheet U_FPC-isoIOs-IOpQuad0104/intGPIOp3, sheet U_FPC-isoIOs-IOpQuad0104/extGPIOp3  [also labelled pExtra02]
ExtStop: R23.1 R26.2 X5.3
~{FAULT}: U8.19(P1_6) ; sheet U_FPC-isoIOs-Power_Protection_AP22653/~{FAULT}
FlexIO01: U3.14(OUTA) U8.13(P1_0) X6.5 ; sheet U_FPC-isoIOs-IOpQuad0912/intGPIOp4, sheet U_FPC-isoIOs-IOpQuad0912/extGPIOp4  [also labelled IO09]
FlexIO02: U3.13(OUTB) U8.14(P1_1) X6.13 ; sheet U_FPC-isoIOs-IOpQuad1316/intGPIOp1, sheet U_FPC-isoIOs-IOpQuad1316/extGPIOp1  [also labelled IO10]
FlexIO03: U3.12(INC) U8.15(P1_2) X6.6 ; sheet U_FPC-isoIOs-IOpQuad1316/intGPIOp2, sheet U_FPC-isoIOs-IOpQuad1316/extGPIOp2  [also labelled IO11]
FlexIO04: U3.11(IND) U8.16(P1_3) X6.14 ; sheet U_FPC-isoIOs-IOpQuad1316/intGPIOp3, sheet U_FPC-isoIOs-IOpQuad1316/extGPIOp3  [also labelled IO12]
FlexIO05: U12.4(B) X6.7 ; sheet U_FPC-isoIOs-IOpQuad1316/intGPIOp4, sheet U_FPC-isoIOs-IOpQuad1316/extGPIOp4  [also labelled IO13]
~{INT}: R22.1 U4.12(INC) U8.1(~{INT})
IO01: U8.4(P0_0) X6.1 ; sheet U_FPC-isoIOs-IOpQuad0104/intGPIOp4, sheet U_FPC-isoIOs-IOpQuad0104/extGPIOp4  [also labelled UserIO01]
IO02: U8.5(P0_1) X6.9 ; sheet U_FPC-isoIOs-IOpQuad0508/intGPIOp1, sheet U_FPC-isoIOs-IOpQuad0508/extGPIOp1  [also labelled UserIO02]
IO03: U8.6(P0_2) X6.2 ; sheet U_FPC-isoIOs-IOpQuad0508/intGPIOp2, sheet U_FPC-isoIOs-IOpQuad0508/extGPIOp2  [also labelled UserIO03]
IO04: U8.7(P0_3) X6.10 ; sheet U_FPC-isoIOs-IOpQuad0508/intGPIOp3, sheet U_FPC-isoIOs-IOpQuad0508/extGPIOp3  [also labelled UserIO04]
IO05: U8.8(P0_4) X6.3 ; sheet U_FPC-isoIOs-IOpQuad0508/intGPIOp4, sheet U_FPC-isoIOs-IOpQuad0508/extGPIOp4  [also labelled UserIO05]
IO06: U8.9(P0_5) X6.11 ; sheet U_FPC-isoIOs-IOpQuad0912/intGPIOp1, sheet U_FPC-isoIOs-IOpQuad0912/extGPIOp1  [also labelled UserIO06]
IO07: U8.10(P0_6) X6.4 ; sheet U_FPC-isoIOs-IOpQuad0912/intGPIOp2, sheet U_FPC-isoIOs-IOpQuad0912/extGPIOp2  [also labelled UserIO07]
IO08: U8.11(P0_7) X6.12 ; sheet U_FPC-isoIOs-IOpQuad0912/intGPIOp3, sheet U_FPC-isoIOs-IOpQuad0912/extGPIOp3  [also labelled UserIO08]
isoIOsEnable: U2.5(EN) ; port ENABLE
isoIOsFlex01: U3.3(INA) ; port isoFlexIOs.FlexIO01
isoIOsFlex02: U3.4(INB) ; port isoFlexIOs.FlexIO02
isoIOsFlex03: U3.5(OUTC) ; port isoFlexIOs.FlexIO03
isoIOsFlex04: U3.6(OUTD) ; port isoFlexIOs.FlexIO04
isoIOsFlex05: U4.3(INA) ; port isoFlexIOs.FlexIO05
isoIOs~{INT}: U4.5(OUTC) ; port isoIOsCtrl.~{INT}
isoIOs~{RST}: U4.4(INB) ; port isoIOsCtrl.~{RST}
isoIOsSCL: R16.2 U5.7(SDA2) ; port I2C.SCL
isoIOsSDA: R17.2 U5.6(SCL2) ; port I2C.SDA
isoSCL: R20.2 U5.2(SDA1) U8.22(SCL)
isoSDA: R21.2 U5.3(SCL1) U8.23(SDA)
pExtStop: R23.2 U4.11(IND) ; sheet U_FPC-isoIOs-IOpQuad0104/intGPIOp1, sheet U_FPC-isoIOs-IOpQuad0104/extGPIOp1
~{RST}: R24.1 U8.3(~{RESET})
NetC29_2: C29.2 C30.2 D1.1(K) D2.1(K) U7.3(IN)
NetD1_2: D1.2(A) U6.6
NetD2_2: D2.2(A) U6.4
NetR19_1: R19.1 R24.2 U4.13(OUTB)
NetR44_1: R44.1 X5.4
NetU2_1: U2.1(D1) U6.3
NetU2_3: U2.3(D2) U6.1
NetU4_14: U4.14(OUTA) U12.3(A)

Not connected (* = marked no-connect by the designer): U2 6(CLK); U3 7(EN1); U4 7(EN1); X5 MH1 MH2; X6 S1(MH1) S2(MH2)

### Layout directives
net class PWR: 3V3isoIOs, GNDisoIOs, NetC29_2, NetD1_2, NetD2_2, NetR44_1, NetU2_1, NetU2_3

### Notes on the sheet
- UltraZohm side
- Isolated side
- (near U8) I²C address: 0b1110100 = 0x74
- 4x
- (near X6) IsoIOs
- (near U8) FlexIO01
- UserIO01
- UserIO02
- UserIO03
- UserIO04
- UserIO05
- (near U8) FlexIO02
- (near U8) FlexIO03
- (near U8) FlexIO04
- UserIO06
- UserIO07
- UserIO08
- FlexIO01
- FlexIO02
- (near C27) FlexIO01
- FlexIO03
- FlexIO04
- FlexIO05
- (near C27) FlexIO02
- (near C27) FlexIO03
- S³C / SoM
- I²C
- Out / SCLK
- Out / MOSI
- In / MISO
- In
- I/O
- S* of @{"Id":"YNIXFAUB\IFFCDLIH","ObjectType":2} and MH* of @{"Id":"YNIXFAUB\GOGXKONJ","ObjectType":2}, as of Rev04½, are left NC to avoid GND links via the FP!
- The five isoIOs 09 - 13 (cf. @{"Id":"YNIXFAUB\IFFCDLIH","ObjectType":2}) are S³C-enabled FlexIOs & have
  additional/different capabilities:
  - FlexIOs 0[125] can be S³C outs
  - FlexIOs 03/04 are S³C inputs at
  all times but might be driven by
  @{"Id":"YNIXFAUB\EPVSWXBK","ObjectType":2} via I²C or externally (@{"Id":"YNIXFAUB\IFFCDLIH","ObjectType":2})
- Out-SR: ~20Ω
- EnableFlexOs
- Out/♥ / CS*
- 1 (default)
- -
- 0
- External STOP
- (near U4) FlexIO05
- * Alternate/Additional SPI chip select(s) by means of UserIO(s)
- NB: Push/pull!
- (near U4) I²C !RST
- (near U4) I²C !IRQ
- Protection of 3V3isoIOs for internal and external 3V3 rails
- (near R44) Pmax=
- (near R44) 73mW
- (near U2) TODO: Ext. pull-down R?
- (near U2) NB: 3V3 signal
- 3V3isoIOs1: I²C-GPIO (0-14 IOs)
- 3V3isoIOs2: FlexIOs and Outside
- (near R26) Remove @{"Id":"YNIXFAUB\XVRHHUNU","ObjectType":2}/@{"Id":"YNIXFAUB\FFMIYDHB","ObjectType":2} if FPC-isoIOs-IOpSingle is populated - as it also includes PD/S resistors
- V_{S-max}: 5.89V (w/o diode drop)
- NB for Rev01:
- LDO ≤100mA
- Title
- Revision:
- Design Engineer:
- Date:
- Project:
- Sheet
- of
- (in symbol 74LVC1T45DW-7) H; L

### Library data of the parts
C21-C23 C25-C28 C32 = UZgen_C_0603_100nF_50V_X7R: Generic capacitor; Manufacturer: UZgen; Voltage: 50V; Tolerance: 10 %; Created from: AGeiger; Manufacturer Part Number: UZgen_C_0603_100nF_50V_X7R; PartID: 1; Created On: 02/07/2024 14:42:23; Value: 100 nF; Device Package: 0603; Technology: X7R; Mounting Type: SMD; Last Updated: 08/08/2024 15:01:15
C24 C29-C31 = CL10A106MO8NQNC: Capacitor 0603, 16 VDC, 10 µF, X5R; Manufacturer: Samsung Electro-Mechanics; Tolerance: 20 %; Voltage Rating: 16 VDC; Created from: AGeiger; Manufacturer Part Number: CL10A106MO8NQNC; PartID: 101; Created On: 22/08/2022 13:56:44; ComponentLink1Description: Datasheet; ComponentLink1URL: https://datasheet.lcsc.com/lcsc/1810261909_Samsung-Electro-Mechanics-CL10A106MO8NQNC_C92487.pdf; Component Type: Capacitor 0603; Device Package: 0603; Last Updated: 19/11/2024 12:40:46; Mounting Type: SMD; Operating Temperature: -55 - 85°C; Series: X5R; Supplier 1: LCSC; Supplier Part Number 1: C92487; Type: Capacitor; Value: 10 µF; Live Cycle Status: 1; LCSC Part Number: C92487
D1 D2 = PMEG3010ER,115: Schottky Diode, 30 V, 1 A; Manufacturer: Nexperia; Value: 30V; Forward Current: 1 A; Forward Voltage: 320 mV; Reverse Current: 1.5 mA; Created from: VStarost; Manufacturer Part Number: PMEG3010ER,115; PartID: 11; Created On: 02/08/2023 09:58:23; ComponentLink1Description: Datasheet; ComponentLink1URL: https://assets.nexperia.com/documents/data-sheet/PMEG3010ER.pdf; Component Type: Schottky Diode; Device Package: SOD-123-2; Last Updated: 12/05/2025 16:46:15; Mounting Type: SMD; Operating Temperature: -55 to +150 °C; Supplier 1: Mouser; Supplier Part Number 1: 771-PMEG3010ER115; Supplier 2: LCSC; Supplier Part Number 2: C456106; Type: Schottky Diode; Live Cycle Status: 1; LCSC Part Number: C456106; Stock number: not stored; ComponentLink2Description: Homepage; ComponentLink2URL: https://www.nexperia.com/product/PMEG3010ER
R16 R17 = UZgen_R_0603_4k7: Generic resistor; Manufacturer: UZgen; Tolerance: 1 %; Created from: UZgenTool; Manufacturer Part Number: UZgen_R_0603_4k7; PartID: 237; Created On: 02/07/2024 17:29:50; Value: 4k7; Device Package: 0603; Mounting Type: SMD; Last Updated: 02/07/2024 17:29:50
R18 R19 R22-R26 = UZgen_R_0603_10k: Generic resistor; Manufacturer: UZgen; Tolerance: 1 %; Created from: AGeiger; Manufacturer Part Number: UZgen_R_0603_10k; PartID: 1; Created On: 02/07/2024 14:34:53; Value: 10k; Device Package: 0603; Mounting Type: SMD; Last Updated: 02/07/2024 14:37:16
R20 R21 = UZgen_R_0603_2k: Generic resistor; Manufacturer: UZgen; Tolerance: 1 %; Created from: UZgenTool; Manufacturer Part Number: UZgen_R_0603_2k; PartID: 228; Created On: 02/07/2024 17:29:49; Value: 2k; Device Package: 0603; Mounting Type: SMD; Last Updated: 02/07/2024 17:29:49
R44 = UZgen_R_0603_150R: Generic resistor; Manufacturer: UZgen; Tolerance: 1 %; Created from: UZgenTool; Manufacturer Part Number: UZgen_R_0603_150R; PartID: 201; Created On: 02/07/2024 17:29:49; Value: 150R; Device Package: 0603; Mounting Type: SMD; Last Updated: 02/07/2024 17:29:49
U2 = SN6505BDBVR: Low-Noise 1-A Transformer Drivers for Isolated Power Supplies; belongs to SN74AVC4T774RSVR; Manufacturer: Texas Instruments; Created from: MGremer; Manufacturer Part Number: SN6505BDBVR; PartID: 9; Created On: 30/11/2020 13:43:08; ComponentLink1Description: Datasheet; ComponentLink1URL: https://www.ti.com/lit/ds/symlink/sn6505b.pdf; Component Type: Driver Isolated Power Supplies; Device Package: SOT-23; Last Updated: 08/04/2024 08:33:03; Mounting Type: SMD; Supplier 1: Farnell; Supplier Part Number 1: 2507108; Type: Driver Isolated Power Supply; Live Cycle Status: 1; LCSC Part Number: C74518; Stock number: not stored
U3 U4 = ISO6742FDWR: Digital Isolators General-purpose, quad-channel, 2/2 digital isolator; Manufacturer: Texas Instruments; Created from: FRosner; Manufacturer Part Number: ISO6742FDWR; PartID: 5; Created On: 18/06/2024 12:17:11; ComponentLink1Description: Datasheet; ComponentLink1URL: https://www.ti.com/lit/ds/symlink/iso6742.pdf?ts=1718696457648&ref_url=https%253A%252F%252Fwww.mouser.de%252F; Component Type: Digital Isolator; Device Package: SOIC-16; Last Updated: 18/06/2024 14:14:19; Mounting Type: SMD; Operating Temperature: -40 to +125 °C; Series: ISO6742; Supplier 1: Mouser; Supplier Part Number 1: 595-ISO6742FDWR; Supplier 2: LCSC; Supplier Part Number 2: C5216408; Type: Digital Isolator; Value: ISO6742FDWR; LCSC Part Number: C5216408
U5 = ADUM1250ARZ-RL7: Digital Isolators DUAL-Hot-Swappable I²C Isolators; Manufacturer: Analog Devices Inc.; Created from: FRosner; ComponentLink1Description: Datasheet; ComponentLink1URL: https://www.mouser.de/ProductDetail/Analog-Devices/ADUM1250ARZ-RL7?qs=WIvQP4zGangN4422brPwNw%3D%3D; Manufacturer Part Number: ADUM1250ARZ-RL7; PartID: 4; Created On: 11/06/2024 20:40:52; Component Type: Digital Isolator; Device Package: SOIC-8; Last Updated: 01/04/2025 15:00:00; Mounting Type: SMD; Supplier 1: Mouser; Supplier Part Number 1: 584-ADUM1250ARZ-R7; Supplier 2: LCSC; Supplier Part Number 2: C13839; Type: Digital Isolator; Live Cycle Status: 1; LCSC Part Number: C13839; Stock number: not stored
U6 = 750316028: ⁣WE-PPTI Push-Pull Transformers; Manufacturer: Wuerth Elektronik; Created from: MGeier; Manufacturer Part Number: 750316028; PartID: 13; Created On: 03/04/2025 17:26:15; ComponentLink1Description: Datasheet; ComponentLink1URL: https://www.we-online.com/components/products/datasheet/750316028.pdf; Component Type: Push-Pull Transformer; Device Package: Divers; Last Updated: 11/04/2025 14:12:48; Mounting Type: SMD; Supplier 1: LCSC; Supplier Part Number 1: C7589037; Type: Push-Pull Transformer; Live Cycle Status: 1; Stock number: not stored; LCSC Part Number: C7589037; ComponentLink2Description: Homepage; ComponentLink2URL: https://www.we-online.com/en/components/products/WE-PPTI#750316028
U7 = LDL1117S33R: 1.2 A High PSRR low dropout linear voltage regulator, 3.3 V version; Manufacturer: STMicroelectronics; Value: 3.3 V; Created from: MGeier; Manufacturer Part Number: LDL1117S33R; PartID: 19; Created On: 11/04/2025 13:13:45; ComponentLink1Description: Datasheet; ComponentLink1URL: https://www.st.com/resource/en/datasheet/ldl1117.pdf; ComponentLink2Description: Homepage; ComponentLink2URL: https://www.st.com/en/power-management/ldl1117.html; Component Type: LDO; Device Package: SOT223; Last Updated: 11/04/2025 13:23:45; Mounting Type: SMD; Operating Temperature: -40 to +125 °C; Series: LDL1117; Supplier 1: LCSC; Supplier Part Number 1: C435835; Type: LDO; Live Cycle Status: 1; LCSC Part Number: C435835; Stock number: not stored
U8 = PCAL9539APW,118: 400kHz TSSOP-24 I/O Expanders ROHS; Manufacturer: Texas Instruments; Created from: FRosner; ComponentLink2Description: Datasheet; ComponentLink2URL: https://www.nxp.com/docs/en/data-sheet/PCAL9535A.pdf; Manufacturer Part Number: PCAL9539APW,118; PartID: 2; Created On: 18/06/2024 19:29:27; ComponentLink1Description: Datasheet; ComponentLink1URL: https://www.mouser.de/datasheet/2/302/PCAL9539A-3139236.pdf; Component Type: I²C-IO-Expander; Device Package: TSSOP-24; Last Updated: 01/04/2025 15:00:00; Mounting Type: SMD; Supplier 1: Mouser; Supplier Part Number 1: 771-PCAL9539APW118; Supplier 2: LCSC; Supplier Part Number 2: C2669720; Type: I²C IO Expander; Live Cycle Status: 1; LCSC Part Number: C2669720; Stock number: not stored
U12 = 74LVC1T45DW-7: Single-bit Dual Power Supply Translating Transceiver with 3-state Outputs; Manufacturer: Diodes Incorporated; Value: 1.65 - 5.5 V; Created from: MGeier; Manufacturer Part Number: 74LVC1T45DW-7; PartID: 13; Created On: 08/04/2025 19:00:00; ComponentLink1Description: Datasheet; ComponentLink1URL: https://www.diodes.com/datasheet/download/74LVC1T45.pdf; ComponentLink2Description: Cross Reference; ComponentLink2URL: https://www.diodes.com/assets/product-showcases/5825409.pdf#%5B%7B%22num%22%3A1%2C%22gen%22%3A0%7D%2C%7B%22name%22%3A%22Fit%22%7D%5D; ComponentLink3Description: Homepage; ComponentLink3URL: https://www.diodes.com/part/view/74LVC1T45; Component Type: Level Shifter; Device Package: SOT363; Last Updated: 08/04/2025 19:00:00; Mounting Type: SMD; Operating Temperature: –40 to +150 °C; Series: 74LVC1T45; Supplier 1: LCSC; Supplier Part Number 1: C168855; Type: Level Shifter; Live Cycle Status: 1; Stock number: not stored; LCSC Part Number: C168855
X5 = M8S-04PFFR-SF8001: Circular Metric Connectors M8 PANEL R/A PCB 4P F CONN F PIN; Manufacturer: Amphenol; Created from: FRosner; Manufacturer Part Number: M8S-04PFFR-SF8001; PartID: 9; Created On: 14/06/2024 08:06:51; ComponentLink1Description: Datasheet; ComponentLink1URL: https://www.mouser.de/datasheet/2/18/Amphenol_01132017_M8S-04PFFR-SF8001-1156555.pdf; Component Type: Amphenol LTW; Last Updated: 07/07/2024 13:38:13; Mounting Type: THT; Operating Temperature: -40 – 105 °C; Series: Amphenol LTW; Supplier 1: Mouser; Supplier Part Number 1: 523-M8S04PFFRSF8001; Supplier 2: LCSC; Supplier Part Number 2: C18212193; Type: LTW; Live Cycle Status: 1; LCSC Part Number: C18212193; Stock number: not stored
X6 = DS1037-15FNAKT74-0CC: 15 Female D-Sub Shrouded 2 3A -40℃~+85℃ Plugin D-Sub/DVI/HDMI Connectors ROHS; BOM_Manufacturer: Nextron(台湾正凌); Manufacturer: CONNFLY Elec; Contributor: LCSC; Created from: FRosner; BOM_Supplier: LCSC; BOM_Supplier Part: C2846090; BOM_Manufacturer Part: SUB-DRBF-607A-002; BOM_JLCPCB Part Class: Extended Part; spicePre: D; spiceSymbolName: SUB-DRBF-607A-002; Manufacturer Part Number: DS1037-15FNAKT74-0CC; PartID: 10; Created On: 17.03.2023 15:40:49; ComponentLink1Description: Datasheet; ComponentLink1URL: https://jlcpcb.com/partdetail/ConnflyElec-DS1037_15FNAKT740CC/C77835; Component Type: DSUB 15 pole female; Device Package: THT; Last Updated: 04.05.2023 15:17:49; Mounting Type: THT; Operating Temperature: -40℃+105℃; Supplier 1: LCSC; Supplier Part Number 1: C77835; Type: DSUB 15 pole; Live Cycle Status: 1; LCSC Part Number: C77835; Stock number: not stored

## Sheet FPC-isoIOs-IOpQuad.SchDoc
size A4; SheetNumber: 7; SheetTotal: 15
Used 4 times, as channels U_FrontPanelConnectors/U_FPC-isoIOs/U_FPC-isoIOs-IOpQuad0104, U_FrontPanelConnectors/U_FPC-isoIOs/U_FPC-isoIOs-IOpQuad0508, U_FrontPanelConnectors/U_FPC-isoIOs/U_FPC-isoIOs-IOpQuad0912, U_FrontPanelConnectors/U_FPC-isoIOs/U_FPC-isoIOs-IOpQuad1316. Parts and nets are listed once, with the designators drawn on the sheet.
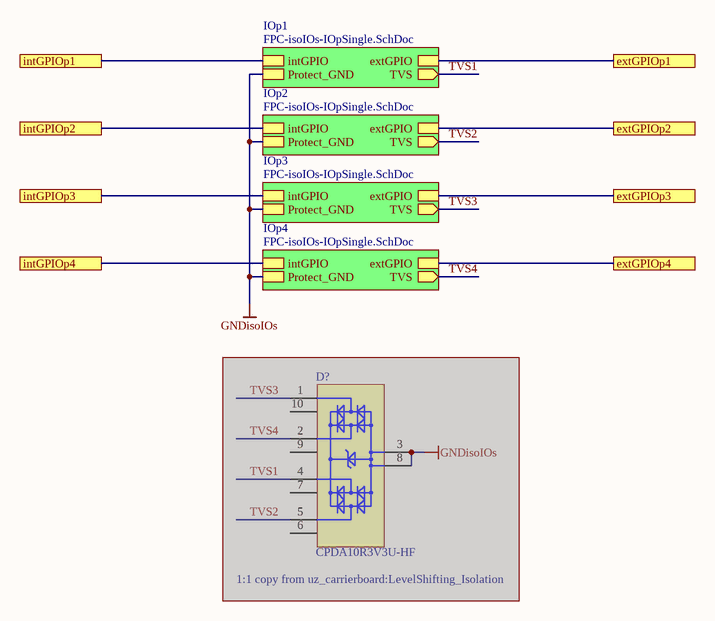
[diagram p7: FPC-isoIOs-IOpQuad.SchDoc]

### Parts
D?  CPDA10R3V3U-HF  [DFN230X100X55X10N]  (masked out: inside a compile mask, not in the netlist)

### Sub-sheets
IOp1 = FPC-isoIOs-IOpSingle.SchDoc: extGPIO, intGPIO, TVS (out), Protect_GND
IOp2 = FPC-isoIOs-IOpSingle.SchDoc: extGPIO, intGPIO, TVS (out), Protect_GND
IOp3 = FPC-isoIOs-IOpSingle.SchDoc: extGPIO, intGPIO, TVS (out), Protect_GND
IOp4 = FPC-isoIOs-IOpSingle.SchDoc: extGPIO, intGPIO, TVS (out), Protect_GND

### Ports
extGPIOp1, extGPIOp2, extGPIOp3, extGPIOp4, intGPIOp1, intGPIOp2, intGPIOp3, intGPIOp4

### Nets
GNDisoIOs: sheet IOp1/Protect_GND, sheet IOp2/Protect_GND, sheet IOp3/Protect_GND, sheet IOp4/Protect_GND
extGPIOp1: port extGPIOp1, sheet IOp1/extGPIO
extGPIOp2: port extGPIOp2, sheet IOp2/extGPIO
extGPIOp3: port extGPIOp3, sheet IOp3/extGPIO
extGPIOp4: port extGPIOp4, sheet IOp4/extGPIO
intGPIOp1: port intGPIOp1, sheet IOp1/intGPIO
intGPIOp2: port intGPIOp2, sheet IOp2/intGPIO
intGPIOp3: port intGPIOp3, sheet IOp3/intGPIO
intGPIOp4: port intGPIOp4, sheet IOp4/intGPIO
TVS1: sheet IOp1/TVS
TVS2: sheet IOp2/TVS
TVS3: sheet IOp3/TVS
TVS4: sheet IOp4/TVS

### Channels
U_FrontPanelConnectors/U_FPC-isoIOs/U_FPC-isoIOs-IOpQuad0104: designators end in A; ports extGPIOp1=pExtStop extGPIOp2=Extra01 extGPIOp3=Extra02 extGPIOp4=IO01 intGPIOp1=pExtStop intGPIOp2=Extra01 intGPIOp3=Extra02 intGPIOp4=IO01
U_FrontPanelConnectors/U_FPC-isoIOs/U_FPC-isoIOs-IOpQuad0508: designators end in B; ports extGPIOp1=IO02 extGPIOp2=IO03 extGPIOp3=IO04 extGPIOp4=IO05 intGPIOp1=IO02 intGPIOp2=IO03 intGPIOp3=IO04 intGPIOp4=IO05
U_FrontPanelConnectors/U_FPC-isoIOs/U_FPC-isoIOs-IOpQuad0912: designators end in C; ports extGPIOp1=IO06 extGPIOp2=IO07 extGPIOp3=IO08 extGPIOp4=FlexIO01 intGPIOp1=IO06 intGPIOp2=IO07 intGPIOp3=IO08 intGPIOp4=FlexIO01
U_FrontPanelConnectors/U_FPC-isoIOs/U_FPC-isoIOs-IOpQuad1316: designators end in D; ports extGPIOp1=FlexIO02 extGPIOp2=FlexIO03 extGPIOp3=FlexIO04 extGPIOp4=FlexIO05 intGPIOp1=FlexIO02 intGPIOp2=FlexIO03 intGPIOp3=FlexIO04 intGPIOp4=FlexIO05

### Notes on the sheet
- (near D?) 1:1 copy from uz_carrierboard:LevelShifting_Isolation
- Title
- Revision:
- Design Engineer:
- Date:
- Project:
- Sheet
- of

### Library data of the parts
D? = 29054: AN: 29054; Voltage: 3.3V; Mixed: SMT; Temperature-Range: -55/+125; Extra: Diode Array TVS Diode ESD Protection 4-channel; Case: TSLP-9-1; HelpURL: b:\AD\adlib\datasheet\CPDA10R3V3U-HF\; H-ART: CPDA10R3V3U-HF